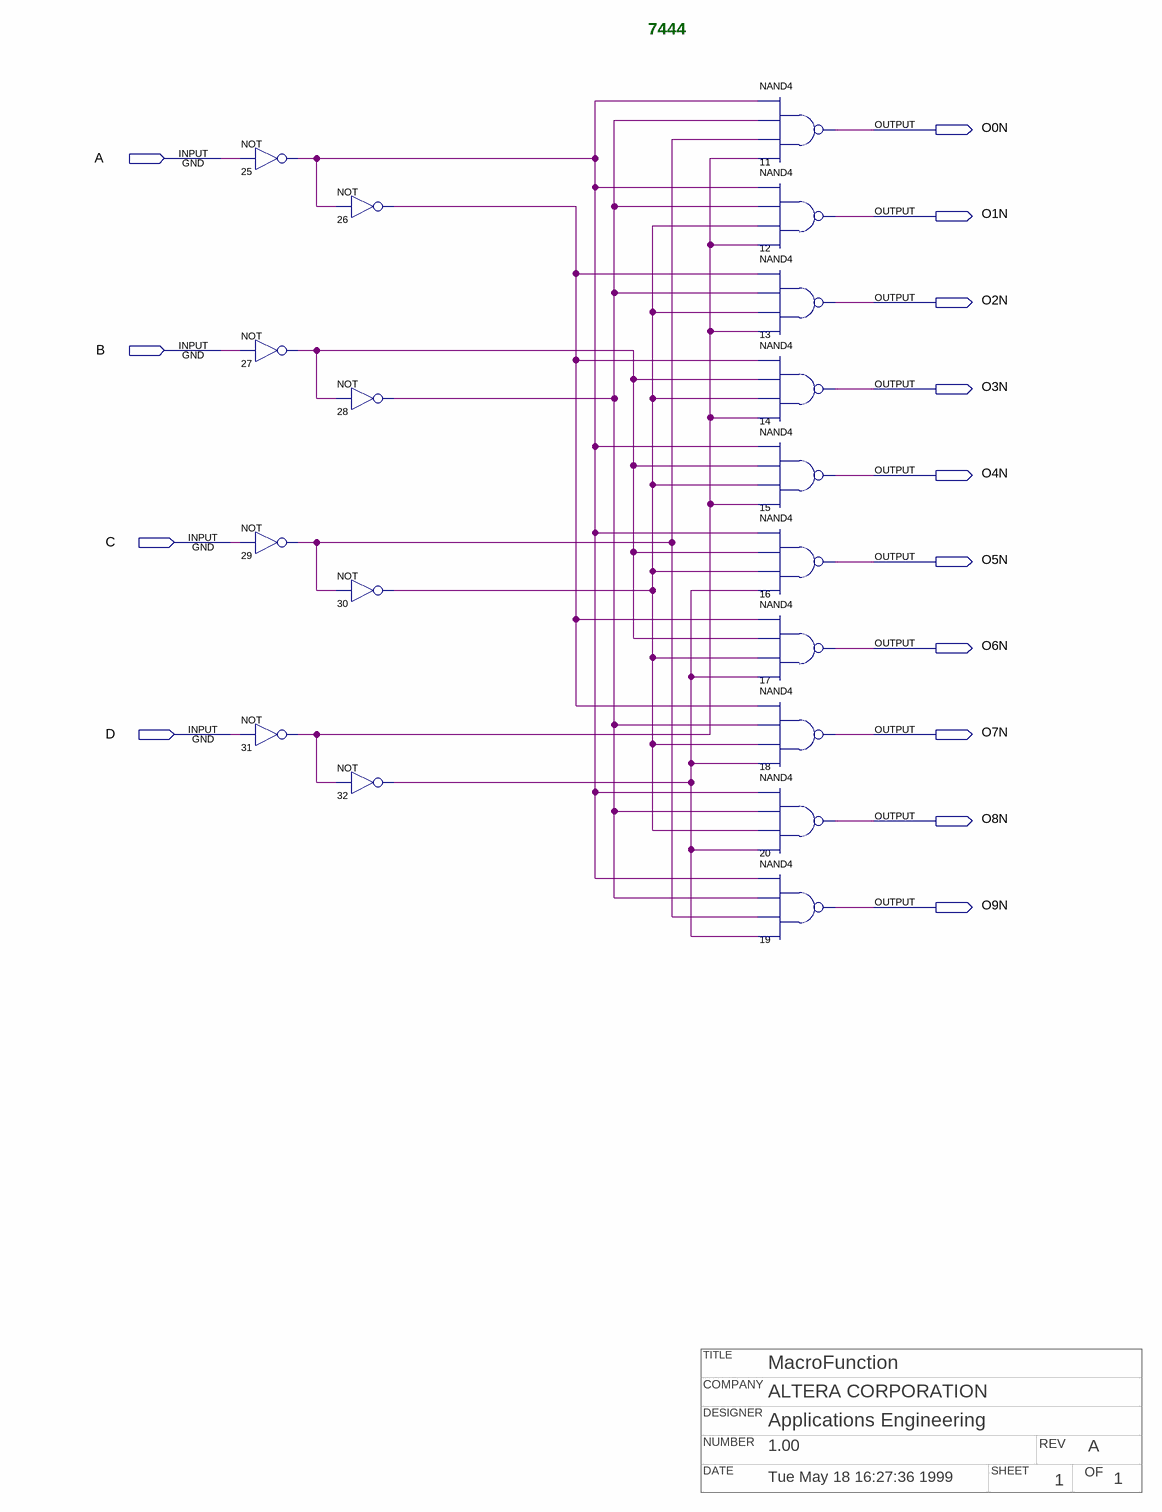
[diagram p0: schematic sheet]
// Quartus schematic 7444.bdf as structural Verilog: 18 symbols, 14 pins
// Title block: TITLE: MacroFunction; COMPANY: ALTERA CORPORATION; DESIGNER: Applications Engineering; NUMBER: 1.00; REV: A; DATE: Tue May 18 16:27:36 1999; SHEET: 1; OF: 1
module \7444  (
  input  A,
  input  B,
  input  C,
  input  D,
  output O0N,
  output O1N,
  output O2N,
  output O3N,
  output O4N,
  output O5N,
  output O6N,
  output O7N,
  output O8N,
  output O9N
);

  wire n25_out, n26_out, n27_out, n28_out, n29_out, n30_out, n31_out, n32_out;

  not u_25 (n25_out, A);
  not u_27 (n27_out, B);
  not u_29 (n29_out, C);
  not u_31 (n31_out, D);
  not u_26 (n26_out, n25_out);
  not u_28 (n28_out, n27_out);
  not u_30 (n30_out, n29_out);
  not u_32 (n32_out, n31_out);
  nand u_11 (O0N, n25_out, n28_out, n29_out, n31_out);
  nand u_12 (O1N, n25_out, n28_out, n30_out, n31_out);
  nand u_13 (O2N, n26_out, n28_out, n30_out, n31_out);
  nand u_14 (O3N, n26_out, n27_out, n30_out, n31_out);
  nand u_15 (O4N, n25_out, n27_out, n30_out, n31_out);
  nand u_16 (O5N, n25_out, n27_out, n30_out, n32_out);
  nand u_17 (O6N, n26_out, n27_out, n30_out, n32_out);
  nand u_18 (O7N, n26_out, n28_out, n30_out, n32_out);
  nand u_20 (O8N, n25_out, n28_out, n30_out, n32_out);
  nand u_19 (O9N, n25_out, n28_out, n29_out, n32_out);

  // Notes on the sheet:
  //   7444
endmodule
